# Altium project dxp.PrjPcb
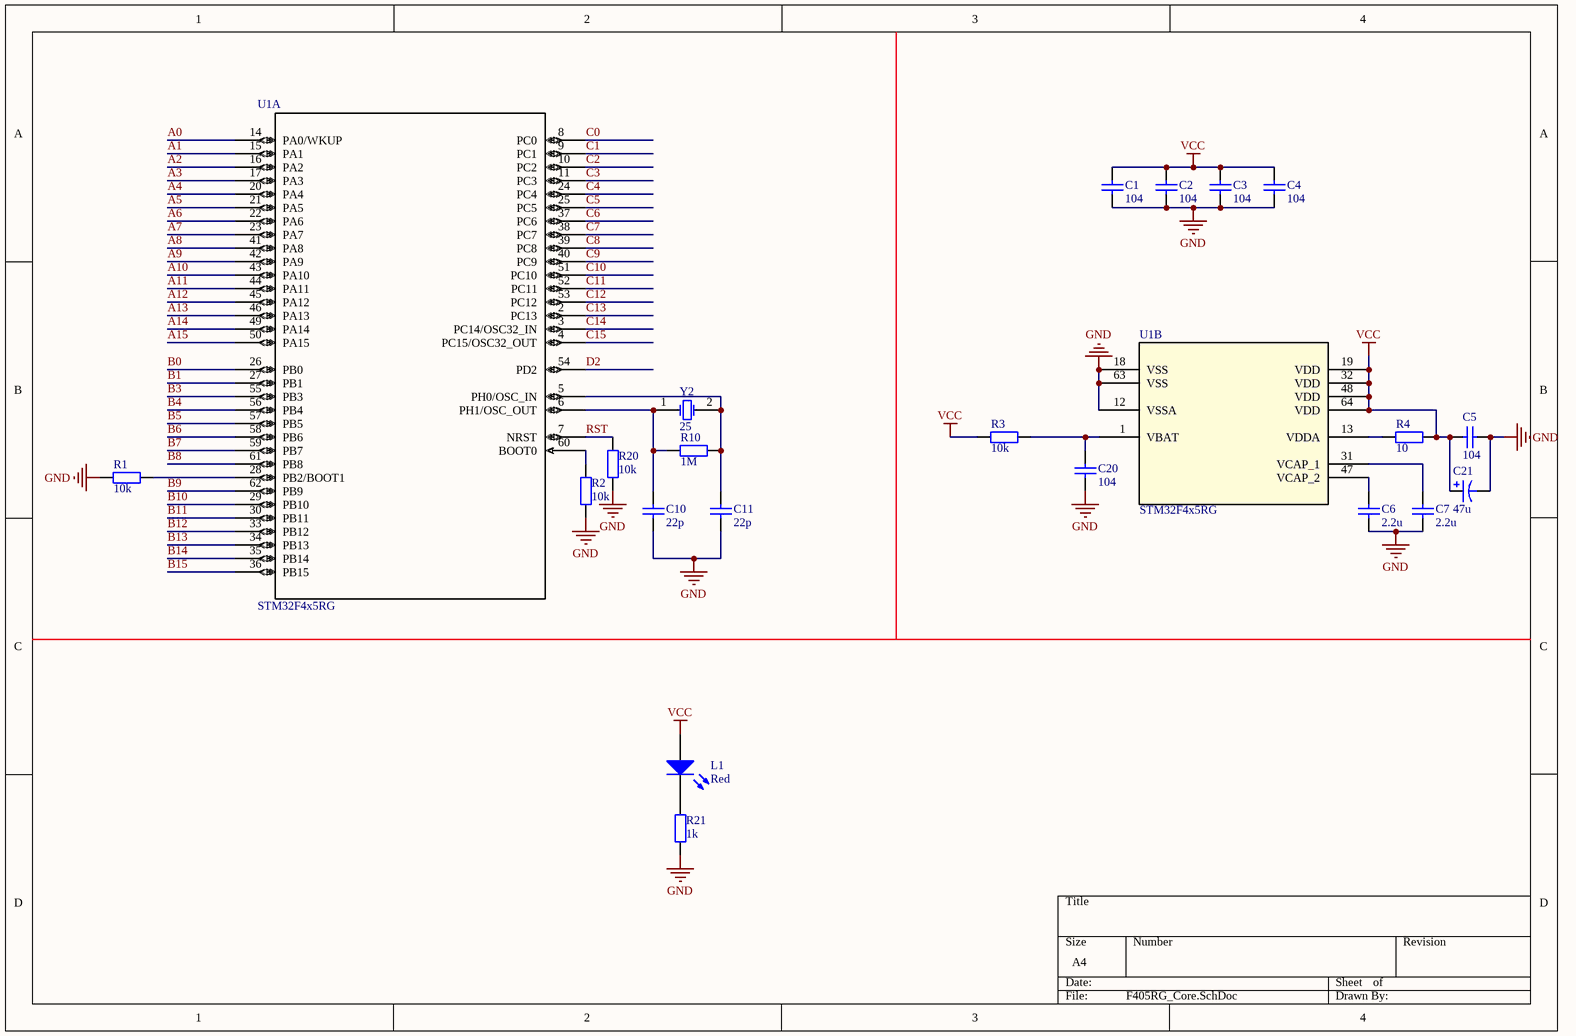
[diagram p0: F405RG_Core.SchDoc]
6 sheets, 74 parts. Net scope: global (net labels, ports and power ports of the same name join across sheets).
Board files: F405RG_Core.PcbDoc, PL2303EVM.PcbDoc, Cam.PcbDoc, NIR.PcbDoc, iTOP4412_main_Clasics_v3_2.PcbDoc, RT8065.PcbDoc
Sheets:
  F405RG_Core.SchDoc
  TlcMini.SchDoc
  F030EVM.SchDoc
  ItopTest.SchDoc
  NIR.SchDoc
  RT8065.SchDoc

## Sheet F405RG_Core.SchDoc
size A4

### Parts
(Parts that share a designator on the sheet are numbered #1, #2 ... from top to bottom, then left to right.)
C1#1  104  [0603]
C2#1  104  [0603]
C3#1  104  [0603]
C4#1  104  [0603]
C5#1  104  [0603]
C6  2.2u  [0603]
C7  2.2u  [0603]
C10#1  22p  [0603]
C11#1  22p  [0603]
C20  104  [0603]
C21  47u  [3528]
L1#1  Red  [0805]
R1#1  10k  [0603]
R2#1  10k  [0603]
R3#1  10k  [0603]
R4#1  10  [0603]
R10#1  1M  [0603]
R20  10k  [0603]
R21  1k  [0603]
U1#1  STM32F4x5RG  [LQFP64-10x10mm]  (parts A,B of 2)
Y2  25  [3225-4]

### Nets
GND: C1#1.1 C2#1.1 C3#1.1 C4#1.1 C5#1.2 C6.1 C7.1 C10#1.2 C11#1.2 C20.1 C21.1 R1#1.1 R2#1.2 R20.1 R21.1 U1#1.12(VSSA) U1#1.18(VSS) U1#1.63(VSS)
VCC: C1#1.2 C2#1.2 C3#1.2 C4#1.2 C5#1.1 C21.2 L1#1.1(A) R3#1.1 R4#1.2 U1#1.19(VDD) U1#1.32(VDD) U1#1.48(VDD) U1#1.64(VDD)
A0: U1#1.14(PA0/WKUP)
A1: U1#1.15(PA1)
A2: U1#1.16(PA2)
A3: U1#1.17(PA3)
A4: U1#1.20(PA4)
A5: U1#1.21(PA5)
A6: U1#1.22(PA6)
A7: U1#1.23(PA7)
A8: U1#1.41(PA8)
A9: U1#1.42(PA9)
A10: U1#1.43(PA10)
A11: U1#1.44(PA11)
A12: U1#1.45(PA12)
A13: U1#1.46(PA13)
A14: U1#1.49(PA14)
A15: U1#1.50(PA15)
B0: U1#1.26(PB0)
B1: U1#1.27(PB1)
B3: U1#1.55(PB3)
B4: U1#1.56(PB4)
B5: U1#1.57(PB5)
B6: U1#1.58(PB6)
B7: U1#1.59(PB7)
B8: U1#1.61(PB8)
B9: U1#1.62(PB9)
B10: U1#1.29(PB10)
B11: U1#1.30(PB11)
B12: U1#1.33(PB12)
B13: U1#1.34(PB13)
B14: U1#1.35(PB14)
B15: U1#1.36(PB15)
C0: U1#1.8(PC0)
C1: U1#1.9(PC1)
C2: U1#1.10(PC2)
C3: U1#1.11(PC3)
C4: U1#1.24(PC4)
C5: U1#1.25(PC5)
C6: U1#1.37(PC6)
C7: U1#1.38(PC7)
C8: U1#1.39(PC8)
C9: U1#1.40(PC9)
C10: U1#1.51(PC10)
C11: U1#1.52(PC11)
C12: U1#1.53(PC12)
C13: U1#1.2(PC13)
C14: U1#1.3(PC14/OSC32_IN)
C15: U1#1.4(PC15/OSC32_OUT)
D2: U1#1.54(PD2)
RST: R20.2 U1#1.7(NRST)
NetC6_2: C6.2 U1#1.47(VCAP_2)
NetC7_2: C7.2 U1#1.31(VCAP_1)
NetC10#1_1: C10#1.1 R10#1.2 U1#1.6(PH1/OSC_OUT) Y2.1(OSC1)
NetC11#1_1: C11#1.1 R10#1.1 U1#1.5(PH0/OSC_IN) Y2.2(OSC2)
NetC20_2: C20.2 R3#1.2 U1#1.1(VBAT)
NetL1#1_2: L1#1.2(K) R21.2
NetR1#1_2: R1#1.2 U1#1.28(PB2/BOOT1)
NetR2#1_1: R2#1.1 U1#1.60(BOOT0)
NetR4#1_1: R4#1.1 U1#1.13(VDDA)

### Library data of the parts
C1#1 C2#1 C3#1 C4#1 C5#1 C6 C7 C10#1 C11#1 C20 = C: Capacitor; Published: 8-Jun-2000; LatestRevisionDate: 17-Jul-2002; LatestRevisionNote: Re-released for DXP Platform.; PackageReference: RAD-0.3; Publisher: Altium Limited; PackageDescription: Radial Cap, Thru-Hole; 2 Leads; 0.3 in Pin Spacing
C21 = Cp: Polarized Capacitor (Axial); Published: 8-Jun-2000; LatestRevisionDate: 17-Jul-2002; LatestRevisionNote: Re-released for DXP Platform.; PackageReference: POLAR0.8; Publisher: Altium Limited; PackageDescription: Polarized Capacitor; 2 Leads
L1#1 = LED: Published: 8-Jun-2000; LatestRevisionDate: 08-Jul-2005; LatestRevisionNote: Mech Layer 1 removed.; PackageReference: LED-0; Publisher: Altium Limited; PackageDescription: LED; 2 Leads
R1#1 R2#1 R3#1 R4#1 R10#1 R20 R21 = R: Resistor; Published: 8-Jun-2000; LatestRevisionDate: 17-Jul-2002; LatestRevisionNote: Re-released for DXP Platform.; PackageReference: AXIAL-0.4; Publisher: Altium Limited; PackageDescription: Axial Device, Thru-Hole; 2 Leads; 0.4 in Pin Spacing
U1#1 = STM32F4x5RG: Mcu; Vendor: STMicroelectronics; C: Copyright (C) 2016 Accelerated Designs. All rights reserved; Manufacturer_Part_Number: stm32f4x5rg; Copyright: Copyright (C) 2016 Accelerated Designs. All rights reserved; RefDes: RefDes; Type: Type; Value: Value
Y2 = XTAL: Crystal Oscillator; pin to pad: 2>3; Published: 8-Jun-2000; LatestRevisionDate: 17-Jul-2002; LatestRevisionNote: Re-released for DXP Platform.; Publisher: Altium Limited

## Sheet TlcMini.SchDoc
size A4
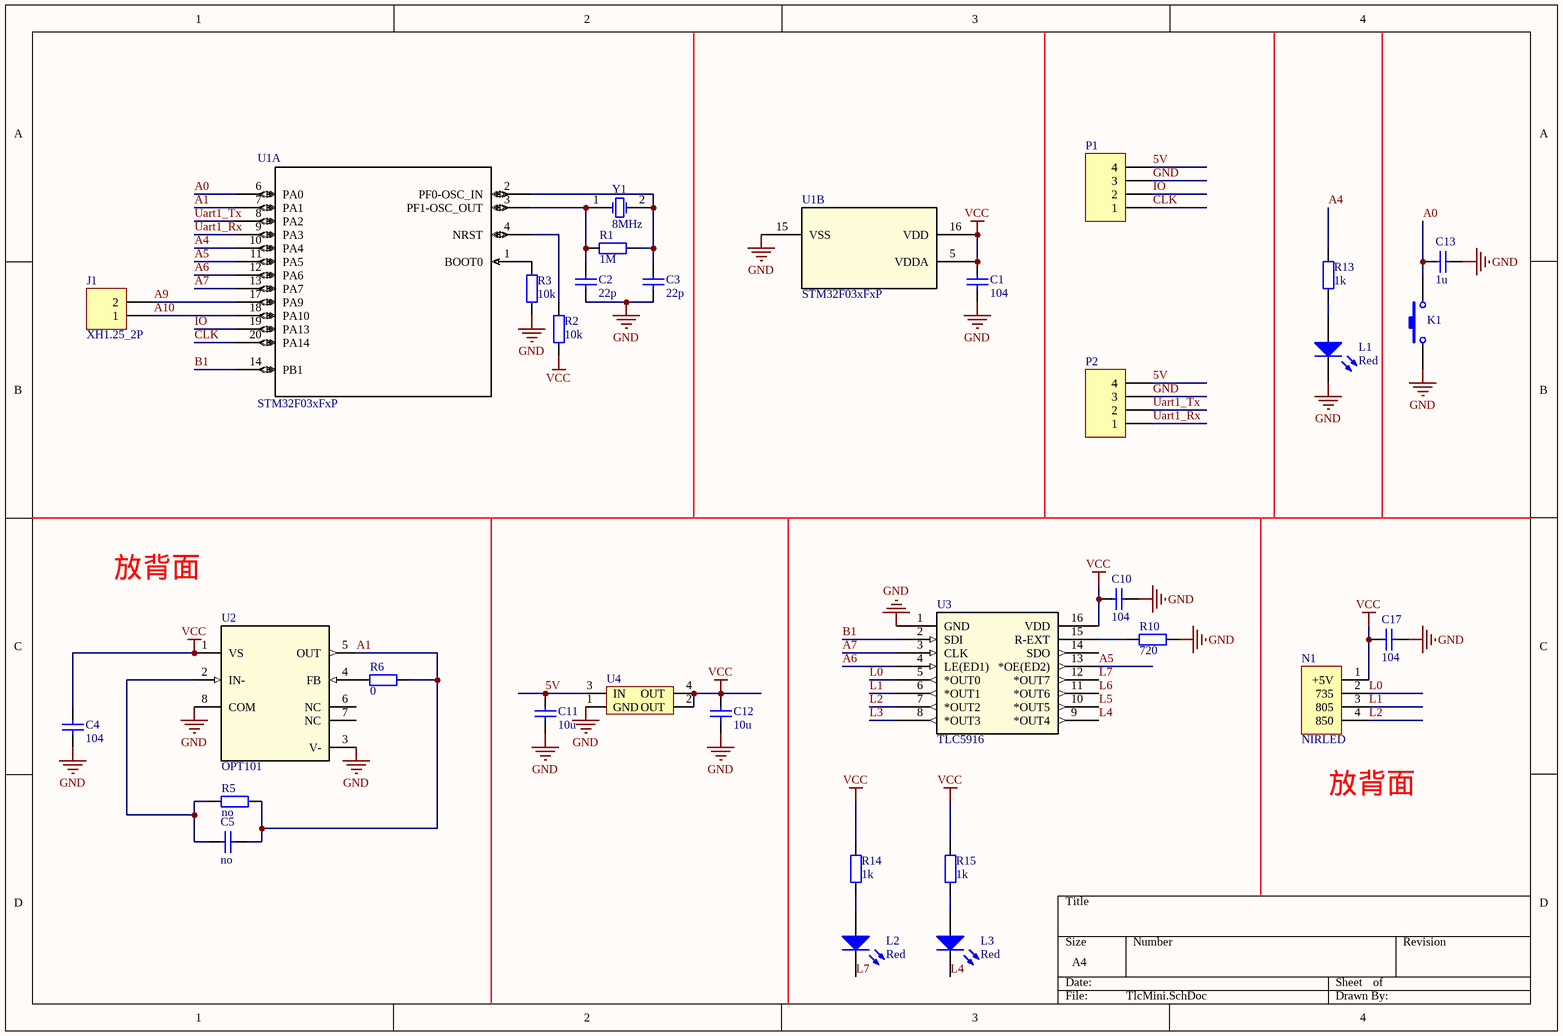
[diagram p1: TlcMini.SchDoc]

### Parts
(Parts that share a designator on the sheet are numbered #1, #2 ... from top to bottom, then left to right.)
C1#2  104  [0805]
C2#2  22p  [0805]
C3#2  22p  [0805]
C4#2  104  [0805]
C5#2  no  [0805]
C10#2  104  [0805]
C11#2  10u  [0805]
C12  10u  [0805]
C13  1u  [0805]
C17  104  [0805]
J1  XH1.25_2P  [XH1.25_2P]
K1  SW  [SWITCH]  (value not drawn)
L1#2  Red  [0805]
L2  Red  [0805]
L3  Red  [0805]
N1#1  NIRLED  [OTP]
P1  Header 4  [HDR1X4]  (value not drawn)
P2  Header 4  [HDR1X4]  (value not drawn)
R1#2  1M  [0805]
R2#2  10k  [0805]
R3#2  10k  [0805]
R5  no  [0805]
R6  0  [0805]
R10#2  720  [0805]
R13  1k  [0805]
R14  1k  [0805]
R15  1k  [0805]
U1#2  STM32F03xFxP  [TSSOP20]  (parts A,B of 2)
U2  OPT101  [NTC8]
U3  TLC5916  [D16]
U4  AMS1117-3.3  [AMS1117]  (value not drawn)
Y1#1  8MHz  [3215-2]

### Nets
GND: C1#2.1 C2#2.1 C3#2.1 C4#2.1 C10#2.2 C11#2.2 C12.2 C13.2 C17.2 K1.1 L1#2.2(K) P1.3 P2.3 R3#2.1 R10#2.2 U1#2.15(VSS) U2.3(V-) U2.8(COM) U3.1(GND) U4.1(GND)
VCC: C1#2.2 C4#2.2 C10#2.1 C12.1 C17.1 N1#1.1(+5V) R2#2.1 R14.2 R15.2 U1#2.5(VDDA) U1#2.16(VDD) U2.1(VS) U3.16(VDD) U4.2(OUT) U4.4(OUT)
5V: C11#2.1 P1.4 P2.4 U4.3(IN)
A0: C13.1 K1.2 U1#2.6(PA0)
A1: C5#2.2 R5.2 R6.2 U1#2.7(PA1) U2.5(OUT)
A4: R13.2 U1#2.10(PA4)
A5: U1#2.11(PA5) U3.13(*OE(ED2))
A6: U1#2.12(PA6) U3.4(LE(ED1))
A7: U1#2.13(PA7) U3.3(CLK)
A9: J1.2 U1#2.17(PA9)
A10: J1.1 U1#2.18(PA10)
B1: U1#2.14(PB1) U3.2(SDI)
CLK: P1.1 U1#2.20(PA14)
IO: P1.2 U1#2.19(PA13)
L0: N1#1.2(735) U3.5(*OUT0)
L1: N1#1.3(805) U3.6(*OUT1)
L2: N1#1.4(850) U3.7(*OUT2)
L3: U3.8(*OUT3)
L4: L3.2(K) U3.9(*OUT4)
L5: U3.10(*OUT5)
L6: U3.11(*OUT6)
L7: L2.2(K) U3.12(*OUT7)
Uart1_Rx: P2.1 U1#2.9(PA3)
Uart1_Tx: P2.2 U1#2.8(PA2)
NetC2#2_2: C2#2.2 R1#2.1 U1#2.3(PF1-OSC_OUT) Y1#1.1(OSC1)
NetC3#2_2: C3#2.2 R1#2.2 U1#2.2(PF0-OSC_IN) Y1#1.2(OSC2)
NetC5#2_1: C5#2.1 R5.1 U2.2(IN-)
NetL1#2_1: L1#2.1(A) R13.1
NetL2_1: L2.1(A) R14.1
NetL3_1: L3.1(A) R15.1
NetR2#2_2: R2#2.2 U1#2.4(NRST)
NetR3#2_2: R3#2.2 U1#2.1(BOOT0)
NetR6_1: R6.1 U2.4(FB)
NetR10#2_1: R10#2.1 U3.15(R-EXT)

Not connected (* = marked no-connect by the designer): U2 6(NC) 7(NC); U3 14(SDO)

### Notes on the sheet
- 放背面
- (near N1#1) 放背面

### Library data of the parts
C1#2 C2#2 C3#2 C4#2 C5#2 C10#2 C11#2 C12 C13 C17 = C: Capacitor; Published: 8-Jun-2000; LatestRevisionDate: 17-Jul-2002; LatestRevisionNote: Re-released for DXP Platform.; PackageReference: RAD-0.3; Publisher: Altium Limited; PackageDescription: Radial Cap, Thru-Hole; 2 Leads; 0.3 in Pin Spacing
J1 = XH1.25_2P: Header, 10-Pin
K1 = SW: Switch
L1#2 L2 L3 = LED: Published: 8-Jun-2000; LatestRevisionDate: 08-Jul-2005; LatestRevisionNote: Mech Layer 1 removed.; PackageReference: LED-0; Publisher: Altium Limited; PackageDescription: LED; 2 Leads
P1 P2 = Header 4: Header, 4-Pin; LatestRevisionDate: 17-Jul-2002; LatestRevisionNote: Re-released for DXP Platform.; Publisher: Altium Limited
R1#2 R2#2 R3#2 R5 R6 R10#2 R13-R15 = R: Resistor; Published: 8-Jun-2000; LatestRevisionDate: 17-Jul-2002; LatestRevisionNote: Re-released for DXP Platform.; PackageReference: AXIAL-0.4; Publisher: Altium Limited; PackageDescription: Axial Device, Thru-Hole; 2 Leads; 0.4 in Pin Spacing
U1#2 = STM32F03xFxP: Mcu; Vendor: STMicroelectronics; C: Copyright (C) 2016 Accelerated Designs. All rights reserved; Copyright: Copyright (C) 2016 Accelerated Designs. All rights reserved; Manufacturer_Part_Number: stm32f03xfxp; RefDes: RefDes; Type: Type; Value: Value
U2 = OPT101: Sence; PartNumber: OPT101P-J; Manufacturer: Texas Instruments; CompType: IC; PIN_COUNT: 8; Application_BuildNumber: *; PackageReference: DTL0008A; MountType: SMT; RoHS: Y; RefDes: RefDes; TYPE: TYPE; Value: Value
U3 = TLC5916: Driver; Manufacturer_Part_Number: tlc5916-q1_d_16; GENERIC_PART_NUMBER: TLC5916-Q1; Vendor: Texas Instruments; PACKAGE_DESIGNATOR: D; PIN_COUNT: 16; FAMILY_NAME: LED DRIVER; INDUSTRY_STD_PKG_TYPE: SOIC; Manufacturer: Texas Instruments; Datasheet_URL: http://www.ti.com/lit/gpn/TLC5916-Q1; Value: Value; Type: Type; RefDes: RefDes
U4 = AMS1117
Y1#1 = XTAL: Crystal Oscillator; Published: 8-Jun-2000; LatestRevisionDate: 17-Jul-2002; LatestRevisionNote: Re-released for DXP Platform.; Publisher: Altium Limited

## Sheet F030EVM.SchDoc
size A4
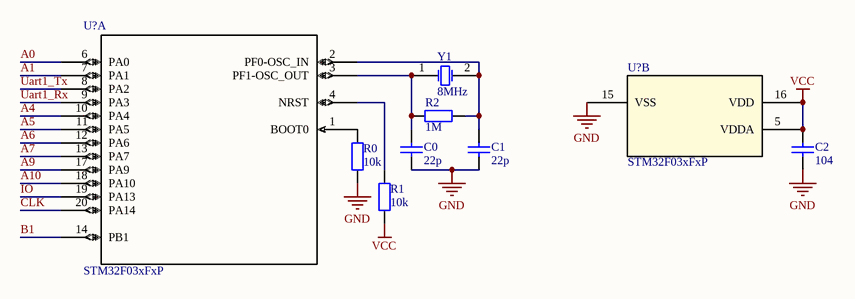
[diagram p2: F030EVM.SchDoc]

### Parts
(Parts that share a designator on the sheet are numbered #1, #2 ... from top to bottom, then left to right.)
C0  22p  [0805]
C1#3  22p  [0805]
C2#3  104  [0805]
R0  10k  [0805]
R1#3  10k  [0805]
R2#3  1M  [0805]
U?#1  STM32F03xFxP  [TSSOP20]  (part A of 2)
U?#2  STM32F03xFxP  [TSSOP20]  (part B of 2)
Y1#2  8MHz  [3215-2]

### Nets
GND: C0.1 C1#3.1 C2#3.1 R0.1 U?#2.15(VSS)
VCC: C2#3.2 R1#3.1 U?#2.5(VDDA) U?#2.16(VDD)
A0: U?#1.6(PA0)
A1: U?#1.7(PA1)
A4: U?#1.10(PA4)
A5: U?#1.11(PA5)
A6: U?#1.12(PA6)
A7: U?#1.13(PA7)
A9: U?#1.17(PA9)
A10: U?#1.18(PA10)
B1: U?#1.14(PB1)
CLK: U?#1.20(PA14)
IO: U?#1.19(PA13)
Uart1_Rx: U?#1.9(PA3)
Uart1_Tx: U?#1.8(PA2)
NetC0_2: C0.2 R2#3.1 U?#1.3(PF1-OSC_OUT) Y1#2.1(OSC1)
NetC1#3_2: C1#3.2 R2#3.2 U?#1.2(PF0-OSC_IN) Y1#2.2(OSC2)
NetR0_2: R0.2 U?#1.1(BOOT0)
NetR1#3_2: R1#3.2 U?#1.4(NRST)

### Library data of the parts
C0 C1#3 C2#3 = C: Capacitor; Published: 8-Jun-2000; LatestRevisionDate: 17-Jul-2002; LatestRevisionNote: Re-released for DXP Platform.; PackageReference: RAD-0.3; Publisher: Altium Limited; PackageDescription: Radial Cap, Thru-Hole; 2 Leads; 0.3 in Pin Spacing
R0 R1#3 R2#3 = R: Resistor; Published: 8-Jun-2000; LatestRevisionDate: 17-Jul-2002; LatestRevisionNote: Re-released for DXP Platform.; PackageReference: AXIAL-0.4; Publisher: Altium Limited; PackageDescription: Axial Device, Thru-Hole; 2 Leads; 0.4 in Pin Spacing
U?#1 U?#2 = STM32F03xFxP: as U1#2 on sheet TlcMini; Copyright: Copyright (C) 2016 Accelerated Designs. All rights reserved; Manufacturer_Part_Number: stm32f03xfxp; RefDes: RefDes; Type: Type; Value: Value
Y1#2 = XTAL: Crystal Oscillator; Published: 8-Jun-2000; LatestRevisionDate: 17-Jul-2002; LatestRevisionNote: Re-released for DXP Platform.; Publisher: Altium Limited

## Sheet ItopTest.SchDoc
size A2
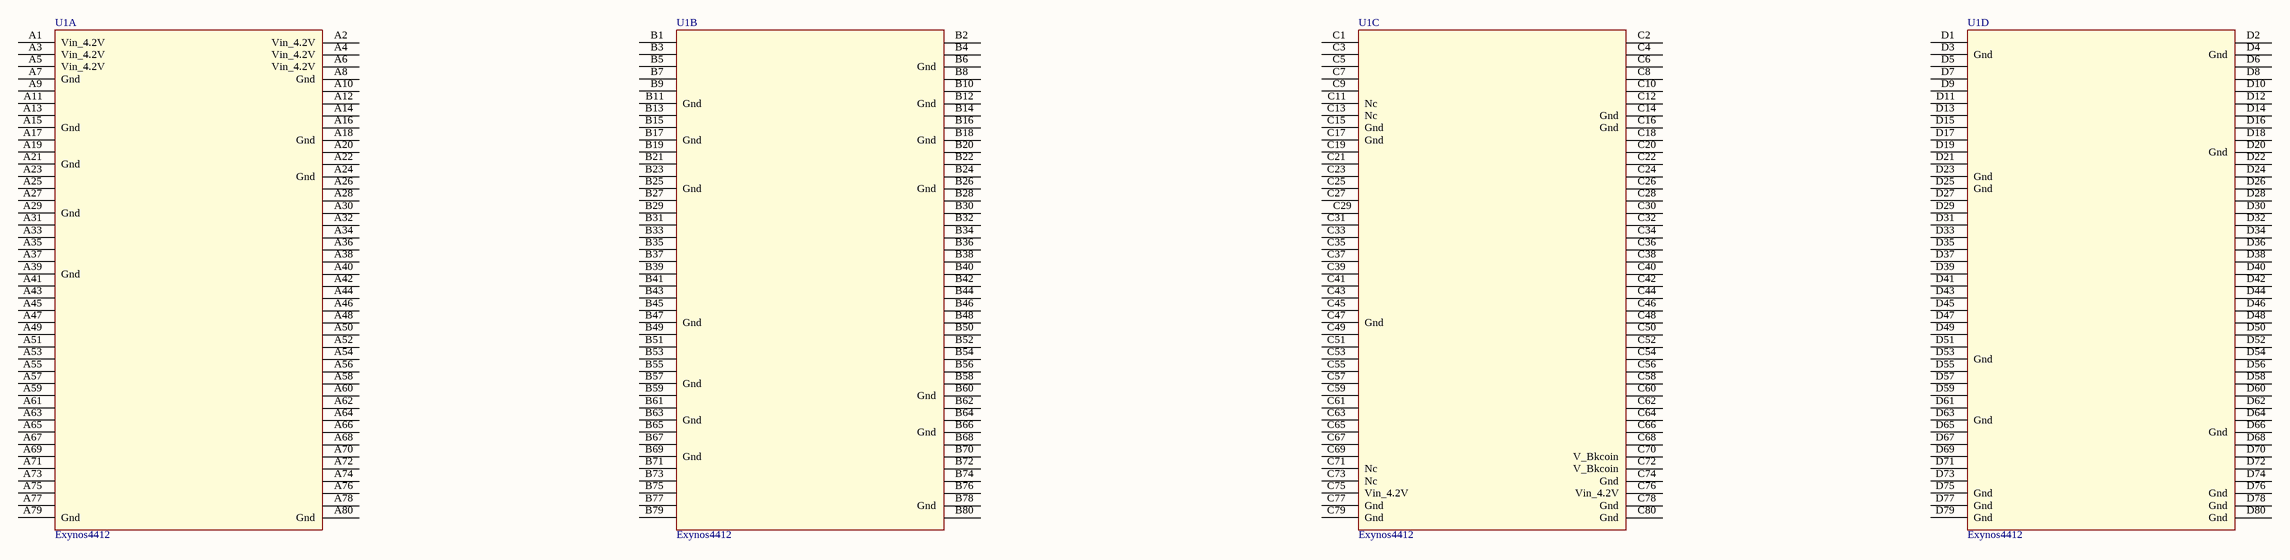
[diagram p3: ItopTest.SchDoc]

### Parts
(Parts that share a designator on the sheet are numbered #1, #2 ... from top to bottom, then left to right.)
U1#3  Exynos4412  [Exynos4412]  (parts A,B,C,D of 4)

### Nets

Not connected (* = marked no-connect by the designer): U1#3 A1(Vin_4.2V) A2(Vin_4.2V) A3(Vin_4.2V) A4(Vin_4.2V) A5(Vin_4.2V) A6(Vin_4.2V) A7(Gnd) A8(Gnd) A9 A10 A11 A12 A13 A14 A15(Gnd) A16 A17 A18(Gnd) A19 A20 A21(Gnd) A22 A23 A24(Gnd) A25 A26 A27 A28 A29(Gnd) A30 A31 A32 A33 A34 A35 A36 A37 A38 A39(Gnd) A40 A41 A42 A43 A44 A45 A46 A47 A48 A49 A50 A51 A52 A53 A54 A55 A56 A57 A58 A59 A60 A61 A62 A63 A64 A65 A66 A67 A68 A69 A70 A71 A72 A73 A74 A75 A76 A77 A78 A79(Gnd) A80(Gnd) B1 B2 B3 B4 B5 B6(Gnd) B7 B8 B9 B10 B11(Gnd) B12(Gnd) B13 B14 B15 B16 B17(Gnd) B18(Gnd) B19 B20 B21 B22 B23 B24 B25(Gnd) B26(Gnd) B27 B28 B29 B30 B31 B32 B33 B34 B35 B36 B37 B38 B39 B40 B41 B42 B43 B44 B45 B46 B47(Gnd) B48 B49 B50 B51 B52 B53 B54 B55 B56 B57(Gnd) B58 B59 B60(Gnd) B61 B62 B63(Gnd) B64 B65 B66(Gnd) B67 B68 B69(Gnd) B70 B71 B72 B73 B74 B75 B76 B77 B78(Gnd) B79 B80 C1 C2 C3 C4 C5 C6 C7 C8 C9 C10 C11(Nc) C12 C13(Nc) C14(Gnd) C15(Gnd) C16(Gnd) C17(Gnd) C18 C19 C20 C21 C22 C23 C24 C25 C26 C27 C28 C29 C30 C31 C32 C33 C34 C35 C36 C37 C38 C39 C40 C41 C42 C43 C44 C45 C46 C47(Gnd) C48 C49 C50 C51 C52 C53 C54 C55 C56 C57 C58 C59 C60 C61 C62 C63 C64 C65 C66 C67 C68 C69 C70(V_Bkcoin) C71(Nc) C72(V_Bkcoin) C73(Nc) C74(Gnd) C75(Vin_4.2V) C76(Vin_4.2V) C77(Gnd) C78(Gnd) C79(Gnd) C80(Gnd) D1 D2 D3(Gnd) D4(Gnd) D5 D6 D7 D8 D9 D10 D11 D12 D13 D14 D15 D16 D17 D18 D19 D20(Gnd) D21 D22 D23(Gnd) D24 D25(Gnd) D26 D27 D28 D29 D30 D31 D32 D33 D34 D35 D36 D37 D38 D39 D40 D41 D42 D43 D44 D45 D46 D47 D48 D49 D50 D51 D52 D53(Gnd) D54 D55 D56 D57 D58 D59 D60 D61 D62 D63(Gnd) D64 D65 D66(Gnd) D67 D68 D69 D70 D71 D72 D73 D74 D75(Gnd) D76(Gnd) D77(Gnd) D78(Gnd) D79(Gnd) D80(Gnd)

### Notes on the sheet
- Title
- Size:
- Date:
- File:
- A2
- Number:
- Time:
- Revision:
- Sheet
- of

## Sheet NIR.SchDoc
size A4
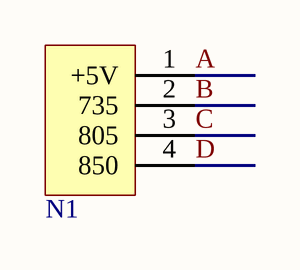
[diagram p4: NIR.SchDoc]

### Parts
(Parts that share a designator on the sheet are numbered #1, #2 ... from top to bottom, then left to right.)
N1#2  NIRLED  [OTP]  (value not drawn)

### Nets
A: N1#2.1(+5V)
B: N1#2.2(735)
C: N1#2.3(805)
D: N1#2.4(850)

## Sheet RT8065.SchDoc
size A4
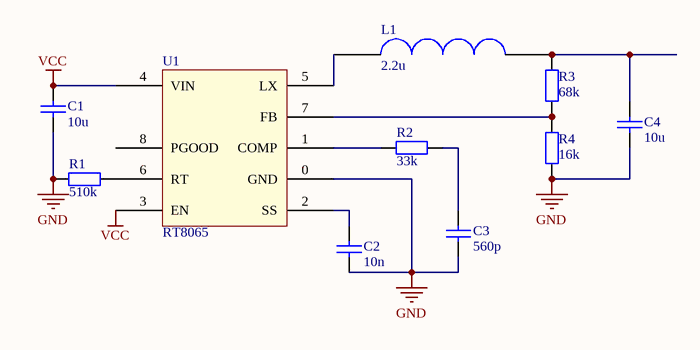
[diagram p5: RT8065.SchDoc]

### Parts
(Parts that share a designator on the sheet are numbered #1, #2 ... from top to bottom, then left to right.)
C1#4  10u  [0805]
C2#4  10n  [0805]
C3#3  560p  [0805]
C4#3  10u  [0805]
L1#3  2.2u  [L3X3MM]
R1#4  510k  [0805]
R2#4  33k  [0805]
R3#3  68k  [0805]
R4#2  16k  [0805]
U1#4  RT8065  [PSOP-8]

### Nets
GND: C1#4.1 C2#4.1 C3#3.2 C4#3.2 R1#4.1 R4#2.1 U1#4.0(GND)
VCC: C1#4.2 U1#4.3(EN) U1#4.4(VIN)
NetC2#4_2: C2#4.2 U1#4.2(SS)
NetC3#3_1: C3#3.1 R2#4.2
NetC4#3_1: C4#3.1 L1#3.2 R3#3.2
NetL1#3_1: L1#3.1 U1#4.5(LX)
NetR1#4_2: R1#4.2 U1#4.6(RT)
NetR2#4_1: R2#4.1 U1#4.1(COMP)
NetR3#3_1: R3#3.1 R4#2.2 U1#4.7(FB)

Not connected (* = marked no-connect by the designer): U1#4 8(PGOOD)

### Library data of the parts
C1#4 C2#4 C3#3 C4#3 = C: Capacitor; Published: 8-Jun-2000; LatestRevisionDate: 17-Jul-2002; LatestRevisionNote: Re-released for DXP Platform.; PackageReference: RAD-0.3; Publisher: Altium Limited; PackageDescription: Radial Cap, Thru-Hole; 2 Leads; 0.3 in Pin Spacing
L1#3 = L
R1#4 R2#4 R3#3 R4#2 = R: Resistor; Published: 8-Jun-2000; LatestRevisionDate: 17-Jul-2002; LatestRevisionNote: Re-released for DXP Platform.; PackageReference: AXIAL-0.4; Publisher: Altium Limited; PackageDescription: Axial Device, Thru-Hole; 2 Leads; 0.4 in Pin Spacing

## Nets that join several sheets
GND: F405RG_Core (18 pins), TlcMini (20 pins), F030EVM (5 pins), RT8065 (7 pins)
VCC: F405RG_Core (13 pins), TlcMini (15 pins), F030EVM (C2#3.2 R1#3.1 U?#2.5 U?#2.16), RT8065 (C1#4.2 U1#4.3 U1#4.4)
A0: F405RG_Core (U1#1.14), TlcMini (C13.1 K1.2 U1#2.6), F030EVM (U?#1.6)
A1: F405RG_Core (U1#1.15), TlcMini (5 pins), F030EVM (U?#1.7)
A4: F405RG_Core (U1#1.20), TlcMini (R13.2 U1#2.10), F030EVM (U?#1.10)
A5: F405RG_Core (U1#1.21), TlcMini (U1#2.11 U3.13), F030EVM (U?#1.11)
A6: F405RG_Core (U1#1.22), TlcMini (U1#2.12 U3.4), F030EVM (U?#1.12)
A7: F405RG_Core (U1#1.23), TlcMini (U1#2.13 U3.3), F030EVM (U?#1.13)
A9: F405RG_Core (U1#1.42), TlcMini (J1.2 U1#2.17), F030EVM (U?#1.17)
A10: F405RG_Core (U1#1.43), TlcMini (J1.1 U1#2.18), F030EVM (U?#1.18)
B1: F405RG_Core (U1#1.27), TlcMini (U1#2.14 U3.2), F030EVM (U?#1.14)
CLK: TlcMini (P1.1 U1#2.20), F030EVM (U?#1.20)
IO: TlcMini (P1.2 U1#2.19), F030EVM (U?#1.19)
Uart1_Rx: TlcMini (P2.1 U1#2.9), F030EVM (U?#1.9)
Uart1_Tx: TlcMini (P2.2 U1#2.8), F030EVM (U?#1.8)